# EAGLE design ZombieDelay (EAGLE 9.5.2)
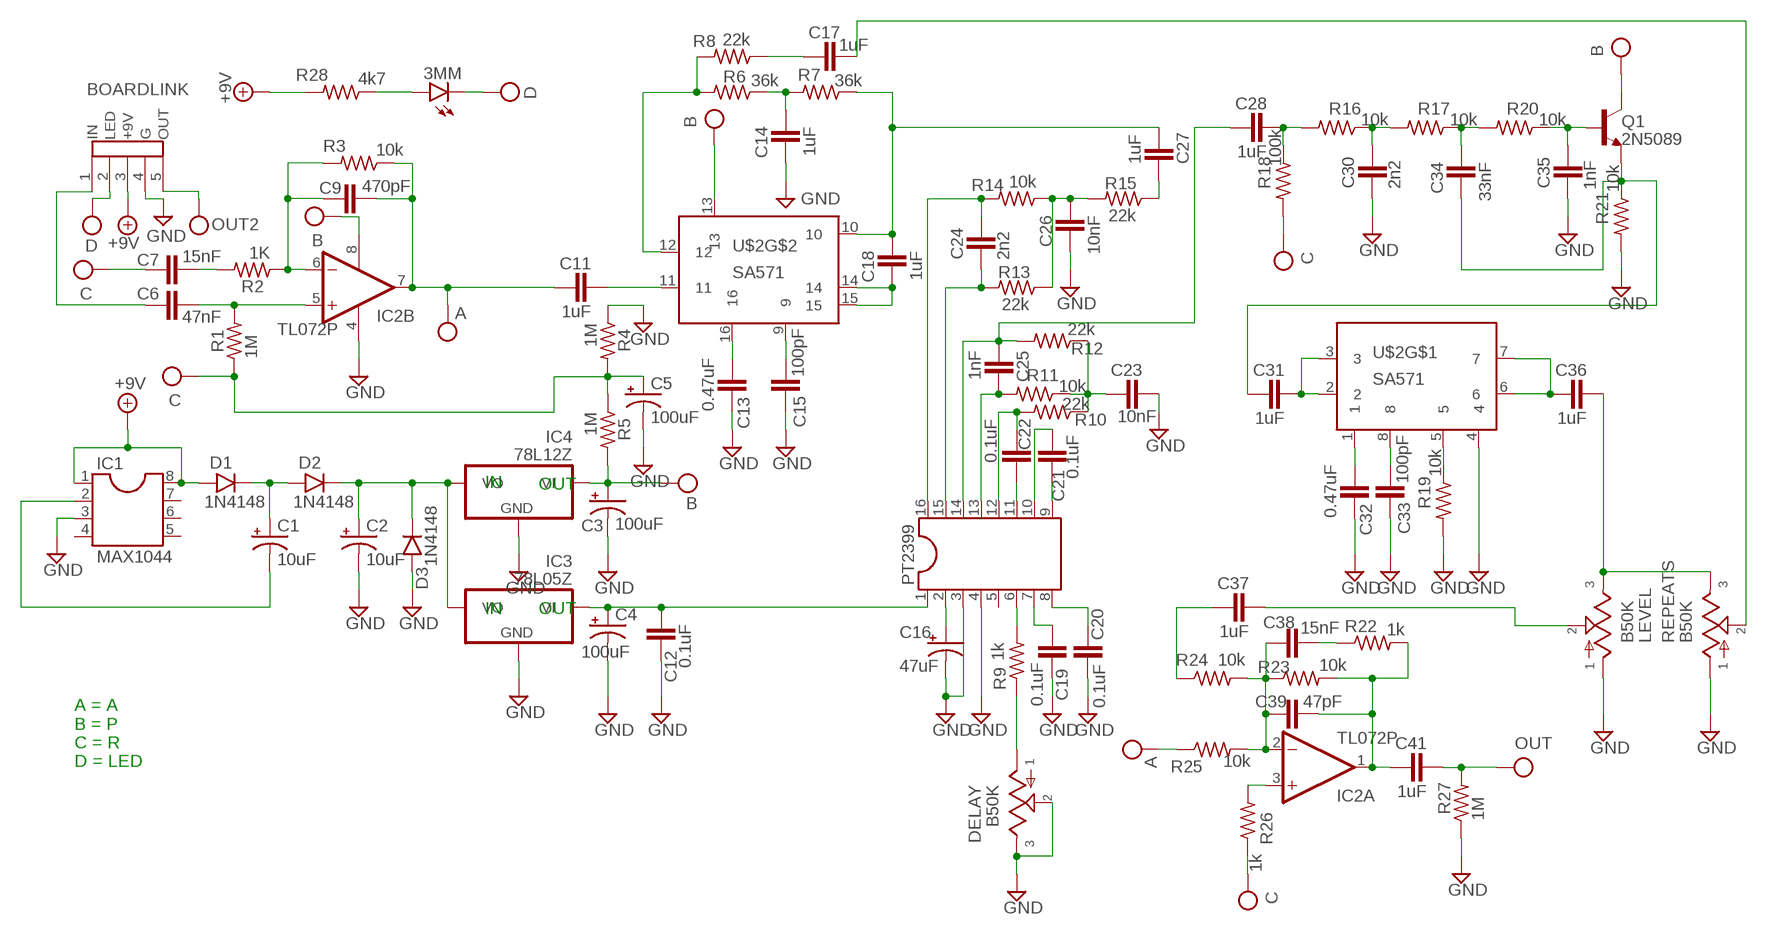
[diagram p0: schematic, sheet 1]

## Parts
3MM  LED3MM  [LED3MM]
C1  10uF  0501  [050_020_1]
C2  10uF  0501  [050_020_1]
C3  100uF  0801  [080_035_1]
C4  100uF  0801  [080_035_1]
C5  100uF  0801  [080_035_1]
C6  47nF  072X0352  [072X035]
C7  15nF  072X0252  [072X025]
C9  470pF  050X030_0251  [050X030_025]
C11  1uF  072X0452  [072X045]
C12  0.1uF  072X0352  [072X035]
C13  0.47uF  072X0352  [072X035]
C14  1uF  072X0452  [072X045]
C15  100pF  050X030_0251  [050X030_025]
C16  47uF  0631  [063_025]
C17  1uF  072X0452  [072X045]
C18  1uF  072X0452  [072X045]
C19  0.1uF  072X0352  [072X035]
C20  0.1uF  072X0352  [072X035]
C21  0.1uF  072X0352  [072X035]
C22  0.1uF  072X0352  [072X035]
C23  10nF  072X0252  [072X025]
C24  2n2  072X0252  [072X025]
C25  1nF  072X0252  [072X025]
C26  10nF  072X0252  [072X025]
C27  1uF  072X0452  [072X045]
C28  1uF  072X0452  [072X045]
C30  2n2  072X0252  [072X025]
C31  1uF  072X0452  [072X045]
C32  0.47uF  072X0352  [072X035]
C33  100pF  050X030_0251  [050X030_025]
C34  33nF  072X0252  [072X025]
C35  1nF  072X0252  [072X025]
C36  1uF  072X0452  [072X045]
C37  1uF  072X0452  [072X045]
C38  15nF  072X0252  [072X025]
C39  47pF  050X030_0251  [050X030_025]
C41  1uF  072X0452  [072X045]
D1  1N4148  1N4148-3  [DO35-3]
D2  1N4148  1N4148-3  [DO35-3]
D3  1N4148  1N4148-3  [DO35-3]
DELAY  B50K  POT16MM_PCB_PADS  [16MM_PCB_PADS]
IC1  MAX1044  [DIL08]
IC2  TL072P  [DIL08]
IC3  78L05Z  [TO92]
IC4  78L12Z  [TO92]
LEVEL  B50K  POT16MM_PCB_PADS  [16MM_PCB_PADS]
PT2399  DIL16  [DIL16]
Q1  2N5089  [TO92-]
R1  1M  6MM.3  [R0207/3]
R2  1K  6MM.3  [R0207/3]
R3  10k  6MM.3  [R0207/3]
R4  1M  6MM.3  [R0207/3]
R5  1M  6MM.3  [R0207/3]
R6  36k  6MM.3  [R0207/3]
R7  36k  6MM.3  [R0207/3]
R8  22k  6MM.3  [R0207/3]
R9  1k  6MM.3  [R0207/3]
R10  22k  6MM.3  [R0207/3]
R11  10k  6MM.3  [R0207/3]
R12  22k  6MM.3  [R0207/3]
R13  22k  6MM.3  [R0207/3]
R14  10k  6MM.3  [R0207/3]
R15  22k  6MM.3  [R0207/3]
R16  10k  6MM.3  [R0207/3]
R17  10k  6MM.3  [R0207/3]
R18  100k  6MM.3  [R0207/3]
R19  10k  6MM.3  [R0207/3]
R20  10k  6MM.3  [R0207/3]
R21  10k  6MM.3  [R0207/3]
R22  1k  6MM.3  [R0207/3]
R23  10k  6MM.3  [R0207/3]
R24  10k  6MM.3  [R0207/3]
R25  10k  6MM.3  [R0207/3]
R26  1k  6MM.3  [R0207/3]
R27  1M  6MM.3  [R0207/3]
R28  4k7  6MM.3  [R0207/3]
REPEATS  B50K  POT16MM_PCB_PADS  [16MM_PCB_PADS]
U$1  BOARDLINK  [BOARDLINK]
U$2  SA571  [DIL16]

## Nets
+9V: D1.A IC1.1 IC1.8 R28.2 U$1.3(+9V)
A: C9.2 C11.1 IC2.7(B:OUT) R3.1 R25.1
B: C3.+ IC2.8(P:V+) IC4.1(VI) Q1.1(C) R5.2 U$2.13
C: C5.+ C7.1 R1.1 R4.2 R5.1 R18.2 R26.1
D: 3MM.K(C) U$1.2(LED)
GND: C2.- C3.- C4.- C5.- C12.1 C13.2 C14.1 C15.1 C16.- C19.2 C20.2 C23.2 C26.1 C30.1 C32.2 C33.1 C35.1 D3.A DELAY.2 DELAY.3 IC1.3 IC2.4(P:V-) IC3.2(GND) IC4.2(GND) LEVEL.1 PT2399.3 PT2399.4 R4.1 R19.2 R21.2 R27.1 REPEATS.1 U$1.4(G) U$2.4
N$1: C2.+ D2.C D3.C IC3.3(VO) IC4.3(VO)
N$2: C1.+ D1.C D2.A
N$3: C1.- IC1.2
N$4: 3MM.A R28.1
N$5: C11.2 U$2.11
N$6: C4.+ C12.2 IC3.1(VI) PT2399.1
N$7: C6.1 U$1.1(IN)
N$8: C6.2 IC2.5(B:+IN) R1.2
N$9: C7.2 R2.2
N$10: C9.1 IC2.6(B:-IN) R2.1 R3.2
N$11: R6.2 R8.2 U$2.12
N$12: C17.1 R8.1
N$13: C14.2 R6.1 R7.2
N$14: C18.1 U$2.14 U$2.15
N$15: C18.2 C27.1 R7.1 U$2.10
N$16: C13.1 U$2.16
N$17: C15.2 U$2.9
N$18: C16.+ PT2399.2
N$19: PT2399.6 R9.2
N$20: DELAY.1 R9.1
N$21: C19.1 PT2399.7
N$22: C20.1 PT2399.8
N$23: C21.2 PT2399.9
N$24: C21.1 PT2399.10
N$25: C22.2 PT2399.11
N$26: C22.1 PT2399.12 R10.2
N$27: C23.1 R10.1 R11.1 R12.1
N$28: C25.1 PT2399.13 R11.2
N$29: C25.2 C28.1 PT2399.14 R12.2
N$30: C24.2 PT2399.16 R14.2
N$31: C24.1 PT2399.15 R13.2
N$32: C27.2 R15.1
N$33: C26.2 R13.1 R14.1 R15.2
N$34: C31.2 U$2.2 U$2.3
N$35: C28.2 R16.2 R18.1
N$36: C30.2 R16.1 R17.2
N$37: C34.2 R17.1 R20.2
N$38: C35.2 Q1.2(B) R20.1
N$39: C31.1 C34.1 Q1.3(E) R21.1
N$40: C38.2 C39.2 IC2.2(A:-IN) R23.1 R24.2 R25.2
N$41: IC2.3(A:+IN) R26.2
N$42: C36.1 U$2.6 U$2.7
N$43: C32.1 U$2.1
N$44: C33.2 U$2.8
N$45: R19.1 U$2.5
N$46: C37.2 LEVEL.2
N$48: C36.2 LEVEL.3 REPEATS.3
N$49: C37.1 R24.1
N$50: C38.1 R22.1
N$51: C39.1 C41.1 IC2.1(A:OUT) R22.2 R23.2
N$52: C17.2 REPEATS.2
OUT: C41.2 R27.2 U$1.5(OUT)
Unconnected: IC1.4 IC1.5 IC1.6 IC1.7 PT2399.5

## Notes on the sheet
- IN | OUT
- IN | OUT
- A = A
  B = P
  C = R
  D = LED

## Library data of the parts
3MM = mb_diodes:LED
C1 C2 = mb_caps-electro:050: 0.22 - 100uF Xicon values at Mouser.com: 10V: 10 - 100uF; 16V: 2.2 - 47uF; 25V: 0.47 - 47uF; 50V: 0.22 - 22uF
C3-C5 = mb_caps-electro:080: 47 - 470uF Xicon values at Mouser.com 10V: 330, 470uF; 16V: 220, 330uF; 25V: 220uF; 50V: 47, 100uF
C6 C12 C13 C19-C22 C32 = mb_caps-box:072X035: 0.15 - 1.0uF; WIMA MKP2 63, 100V: 0.047uF; MKS2 50V: 0.68 - 1.0uF; 63V: 0.33 - 0.47uF; 100V: 0.15 - 0.22uF;
C7 C23-C26 C30 C34 C35 C38 = mb_caps-box:072X025: 1000pF - 0.47uF WIMA MKP2 63, 100V: 1000pF - 0.015uF; MKS2 50V: 0.33 - 0.47uF; 63V: 1000pF - 0.22uF;
C9 C15 C33 C39 = mb_caps-ceramic:050X030_025: 47 - 120pF Xicon Ceramic Disc 2.5mm lead spacing
C11 C14 C17 C18 C27 C28 C31 C36 C37 C41 = mb_caps-box:072X045: 1.5uF WIMA MKS 2 50V: 1.5uF; 63V: 0.68uF; 100V: 0.33uF
C16 = mb_caps-electro:063: 33 - 220uF Xicon values at Mouser.com 10V: 220uF; 16V: 100uF; 25V: 100uF; 50V: 33uF
D1-D3 = mb_diodes:1N4148: Fast Switching Diode DO-35 glass case a.k.a. 1N914
DELAY LEVEL REPEATS = mb_pots:POT: Potentiometers the arrow indicates the clockwise motion of th wiper (lug 2) fully counter clockwise there is no resistance between lugs 1 and 2 fully clockwise the resistance between lugs 1 and 2 is the value of the pot
IC1 = mb_ics:MAX1044
IC2 = mb_ics:TL072: OP AMP
IC3 IC4 = mb_regulators:78*: Positive VOLTAGE REGULATOR Source: http://cache.national.com/ds/LM/LM78L05.pdf http://www.fairchildsemi.com/ds/LM/LM7805.pdf
PT2399 = mb_ics:DIL16
Q1 = mb_trans:2N5089: NPN TRANSISTOR EBC pinout also works for 2N3565
R1-R28 = mb_resistors:6MM: 6mm Resistors Leads spaced 1-6 holes apart for 0.1" perfboard. Suitable for 1/4 watt resistors.
U$1 = xc_library:BOARDLINK
U$2 = xc_library:SA571

## Board
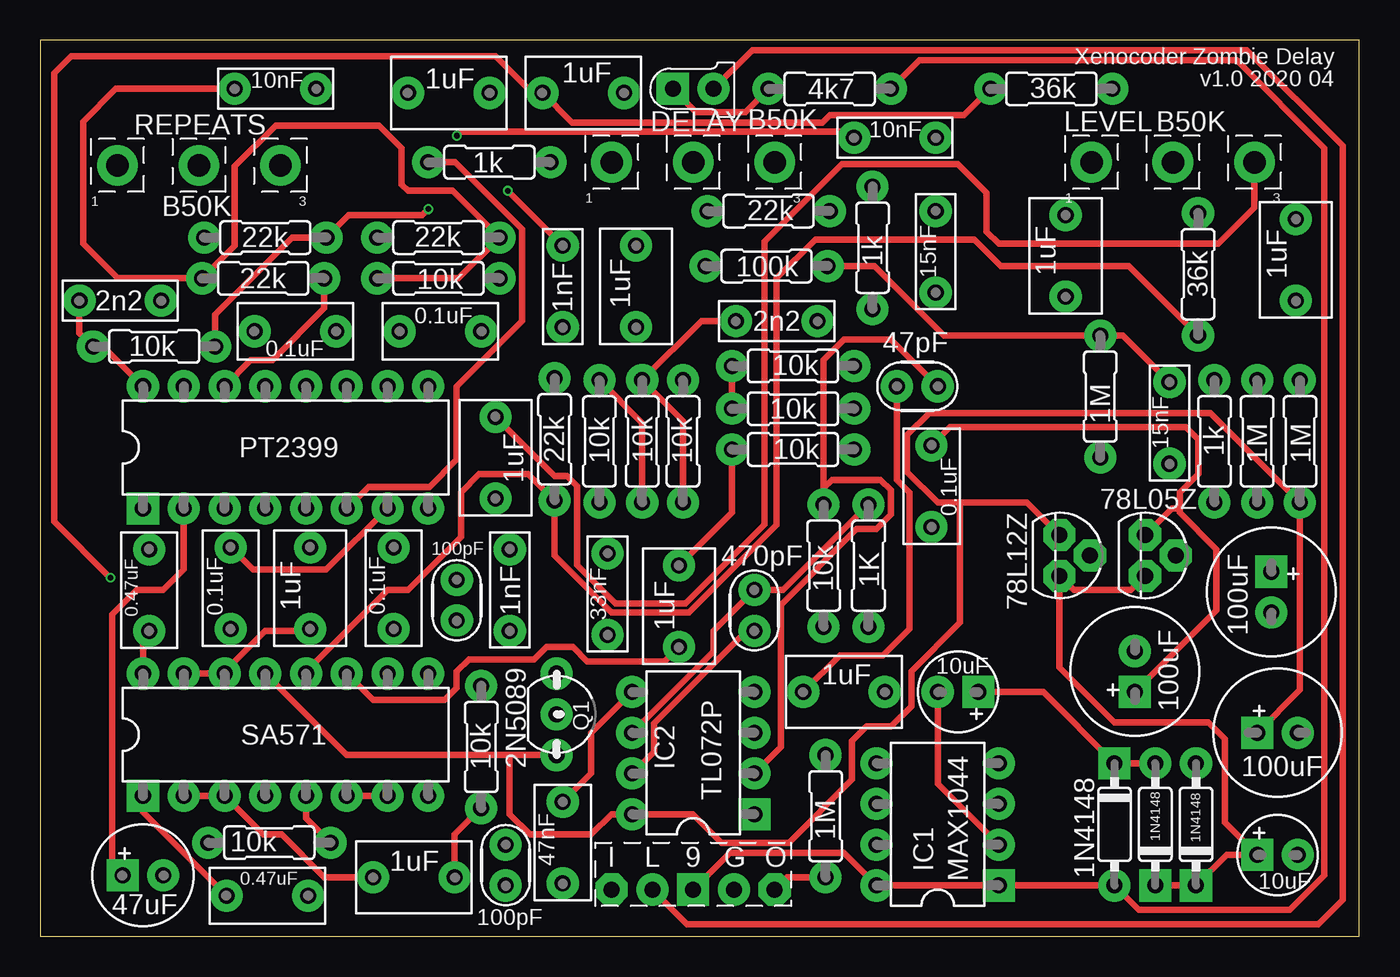
[diagram p1: board, top side]
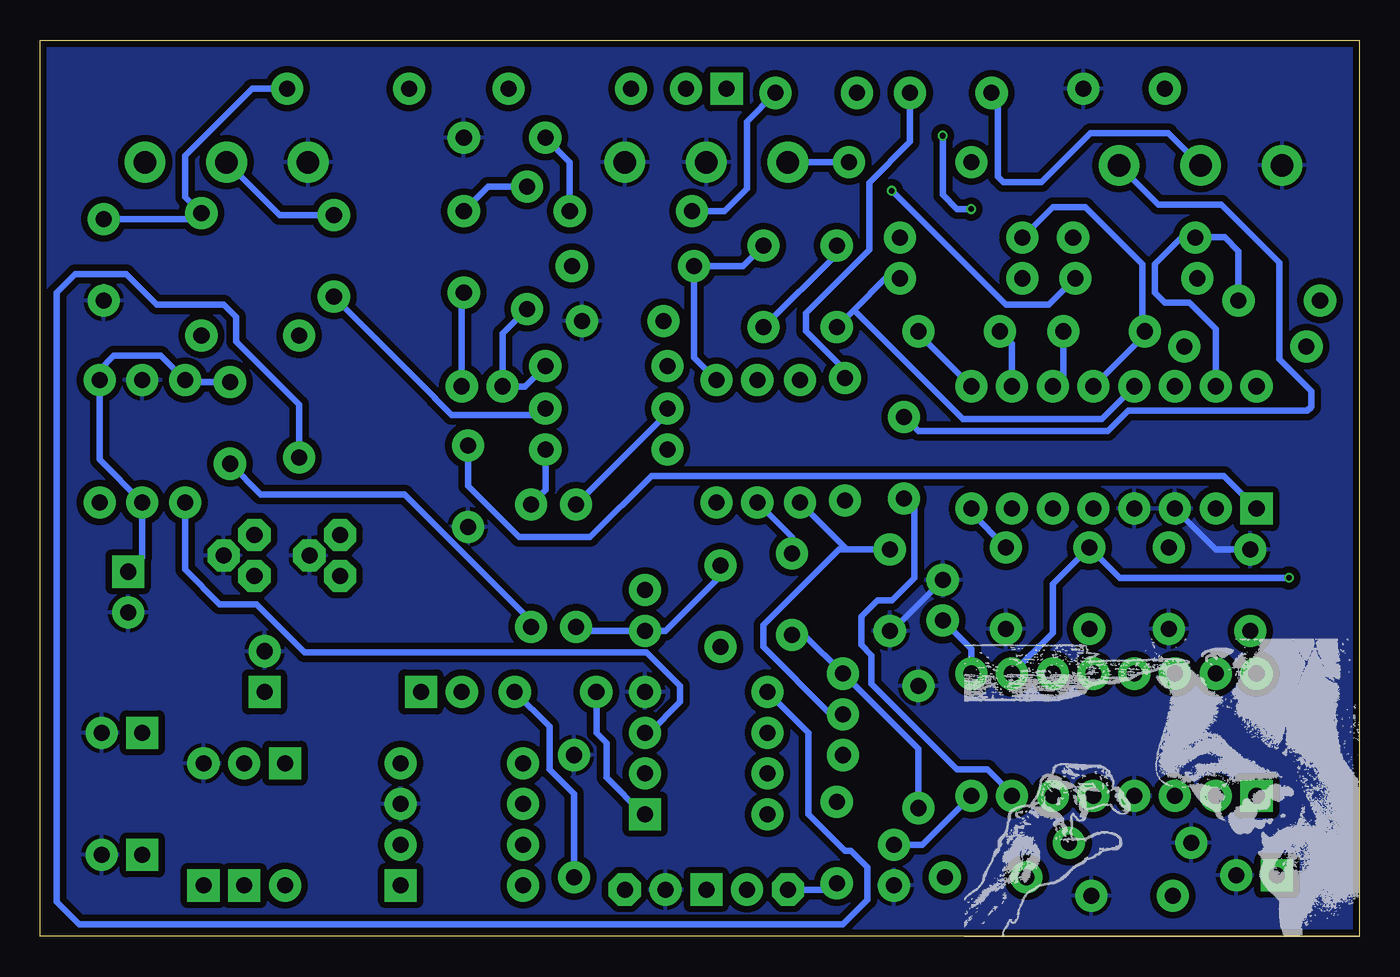
[diagram p2: board, bottom side, seen from below]

Size 82.22 x 55.87 mm. Coordinates in mm from the lower left corner, seen from the top.
Outline: 0,0 82.22,0 82.22,55.87 0,55.87 0,0
Copper layers (1*16): Top 0.035559375mm / dielectric 1.6mm / Bottom 0.035559375mm
Design rules "oshpark-2layer": minimum track width 6mil, minimum drill 10mil, track to track 6mil, track to pad 6mil, pad to pad 6mil, via to via 6mil, smd to smd 6mil, copper to edge 15mil, drill to drill 6mil, minimum pad ring 5mil, minimum via ring 5mil, stop-mask expansion 2.5mil, vias tented up to drill 0mil, thermal gap 10mil

### Footprints (pad centres in the part's own frame; a part is rotated, then mirrored left to right if it is on the bottom)
LED3MM = drill 1 pad 2 square: A -1.27,0 | drill 1 pad 2: K 1.27,0
050_020_1 = drill 1 pad 2 square: + -1.27,0 | drill 1 pad 2: - 1.27,0
080_035_1 = drill 1 pad 2 square: + -1.27,0 | drill 1 pad 2: - 1.27,0
072X035 = drill 1 pad 2: 1 -2.54,0; 2 2.54,0
072X025 = drill 1 pad 2: 1 -2.54,0; 2 2.54,0
050X030_025 = drill 1 pad 2: 1 -1.27,0; 2 1.27,0
072X045 = drill 1 pad 2: 1 -2.54,0; 2 2.54,0
063_025 = drill 1 pad 2 square: + -1.27,0 | drill 1 pad 2: - 1.27,0
DO35-3 = drill 1 pad 2: A 3.81,0 | drill 1 pad 2 square: C -3.81,0
16MM_PCB_PADS = drill 1.4 pad 2.54: 1 5.08,0; 2 0,0; 3 -5.08,0
DIL08 = drill 1 pad 2 square: 1 -3.81,-3.81 | drill 1 pad 2: 2 -1.27,-3.81; 3 1.27,-3.81; 4 3.81,-3.81; 5 3.81,3.81; 6 1.27,3.81; 7 -1.27,3.81; 8 -3.81,3.81
TO92 = drill 1 pad 2 octagon: 1 -1.27,0; 2 0,1.905; 3 1.27,0
DIL16 = drill 1 pad 2 square: 1 -8.89,-3.81 | drill 1 pad 2: 2 -6.35,-3.81; 3 -3.81,-3.81; 4 -1.27,-3.81; 5 1.27,-3.81; 6 3.81,-3.81; 7 6.35,-3.81; 8 8.89,-3.81; 9 8.89,3.81; 10 6.35,3.81; 11 3.81,3.81; 12 1.27,3.81; 13 -1.27,3.81; 14 -3.81,3.81; 15 -6.35,3.81; 16 -8.89,3.81
TO92- = drill 1 pad 2: 1 2.54,0; 2 0,0; 3 -2.54,0
R0207/3 = drill 1 pad 2: 1 -3.81,0; 2 3.81,0
BOARDLINK = drill 1 pad 2 octagon: 1 -2.54,0; 5 7.62,0 | drill 1 pad 2: 2 0,0; 4 5.08,0 | drill 1 pad 2 square: 3 2.54,0

### Placement (x,y rotation side)
3MM  40.7,52.83 0 top
C1  57.21,15.24 180 top
C2  77.12,5.08 0 top
C3  77.12,12.7 0 top
C4  68.23,16.51 90 top
C5  76.74,21.46 270 top
C6  32.57,5.84 90 top
C7  70.39,32 270 top
C9  44.51,20.32 270 top
C11  39.81,20.57 270 top
C12  55.56,28.07 90 top
C13  6.79,21.59 90 top
C14  78.26,42.16 90 top
C15  25.97,20.95 270 top
C16  6.41,3.81 0 top
C17  25.46,52.58 180 top
C18  16.82,21.72 90 top
C19  11.87,21.72 270 top
C20  22.03,21.72 270 top
C21  24.95,37.72 0 top
C22  15.9,37.72 0 top
C23  14.66,52.83 0 top
C24  4.99,39.62 180 top
C25  32.57,40.51 90 top
C26  53.27,49.78 180 top
C27  33.84,52.58 0 top
C28  37.14,40.51 90 top
C30  45.91,38.35 180 top
C31  23.3,3.68 180 top
C32  14.16,2.54 0 top
C33  29.02,4.45 90 top
C34  35.37,21.34 90 top
C35  29.27,21.59 90 top
C36  28.38,29.84 90 top
C37  63.91,42.42 90 top
C38  55.81,42.67 270 top
C39  54.67,34.29 0 top
C41  50.1,15.24 0 top
D1  66.96,6.99 270 top
D2  69.5,6.99 90 top
D3  72.04,6.99 90 top
DELAY  40.7,48.26 180 top
IC1  55.94,6.99 90 top
IC2  40.7,11.43 90 top
IC3  68.86,23.75 270 top
IC4  63.53,23.75 270 top
LEVEL  70.6,48.26 180 top
PT2399  15.3,30.48 0 top
Q1  32.19,13.84 270 top
R1  66.07,33.66 270 top
R2  51.62,23.11 270 top
R3  46.92,30.35 0 top
R4  75.85,30.86 270 top
R5  78.52,30.86 270 top
R6  72.17,41.27 270 top
R7  63.02,52.83 0 top
R8  32.06,30.99 270 top
R9  28,48.26 180 top
R10  24.82,43.56 180 top
R11  24.82,41.02 0 top
R12  13.9,41.02 0 top
R13  14.03,43.56 180 top
R14  7.11,36.77 180 top
R15  45.4,45.21 0 top
R16  40.06,30.86 90 top
R17  37.52,30.86 90 top
R18  45.27,41.78 0 top
R19  14.28,5.84 180 top
R20  34.86,30.86 90 top
R21  27.49,11.81 90 top
R22  51.88,42.93 270 top
R23  46.92,35.56 0 top
R24  46.92,32.89 180 top
R25  48.83,23.11 90 top
R26  73.18,30.86 270 top
R27  48.95,7.49 270 top
R28  49.21,52.83 0 top
REPEATS  9.9,48.06 180 top
U$1  38.16,2.92 0 top
U$2  15.3,12.57 0 top

### Tracks (layer width: path | path; a pad name or v marks a point on that pad's centre or on a via)
+9V
  Top 0.406: U$1.3 42.99,5.21 50.1,5.21 IC1.8 IC1.1 D1.A 68.48,1.65 77.88,1.65 80.04,3.81 80.04,49.15 74.58,54.61 54.8,54.61 R28.2
A
  Top 0.406: IC2.7 38.25,11.52 38.25,13.27 44.03,19.05 C9.2 | C11.1 43.11,26.42 R3.1
  Bottom 0.406: R25.1 48.57,19.05 C9.2 43.24,19.05 39.81,22.48 C11.1
B
  Top 0.406: Q1.1 29.27,11.3 | 29.27,11.3 19.11,11.3 U$2.13 | 29.27,11.3 29.27,7.62 30.54,6.35 34.35,6.35 35.62,7.62 IC2.8 40.7,7.62 42.48,5.84 46.67,5.84 50.61,9.78 50.61,12.19 51.49,13.08 53.02,13.08 54.29,14.35 54.29,16.51 57.34,19.56 57.34,27.05 | C3.+ 78.52,15.37 R5.2 72.93,32.64 55.43,32.64 54.03,31.24 54.03,28.96 55.94,27.05 57.34,27.05 | 57.34,27.05 61.5,27.05 IC4.1
C
  Top 0.406: R18.2 52,41.78 56.32,37.47 R1.1 67.47,37.47 C7.1
  Bottom 0.406: C7.1 73.06,34.54 R26.1 74.71,36.2 77.63,36.2 78.52,35.31 R5.1 78.52,29.72 R4.2 75.85,23.62 C5.+
D
  Top 0.406: U$1.2 40.32,0.76 79.66,0.76 81.18,2.29 81.18,49.28 75.22,55.24 44.38,55.24 3MM.K
GND
  Bottom 0.406: PT2399.3 8.95,24.13 C13.2 | C35.1 29.14,19.05 C15.1
  pour Bottom (isolate 0.406): 0,0 0,55.88 82.55,55.88 82.55,0
N$1
  Top 0.406: D2.C D3.C 73.94,5.08 C2.+ 73.82,7.11 73.82,12.32 72.8,13.34 66.96,13.34 63.53,16.76 IC4.3 64.42,21.59 67.98,21.59 IC3.3
N$2
  Top 0.406: D2.A D1.C 62.52,15.24 C1.+
N$3
  Top 0.406: IC1.2 55.94,9.53 C1.-
N$4
  Top 0.406: R28.1 43.95,51.38 40.88,51.38 3MM.A
N$5
  Top 0.406: U$2.11 20.76,14.73 25.21,14.73 25.97,15.49 25.97,16.51 26.73,17.27 30.79,17.27 31.56,18.03 33.21,18.03 34.1,17.14 38.92,17.14 C11.2
N$6
  Top 0.406: C12.2 56.7,31.75 71.41,31.75 72.17,30.99 72.17,28.83 71.02,27.69 71.02,26.67 | 71.02,26.67 71.02,26.42 73.31,24.13 73.31,20.32 C4.+ | IC3.1 70.52,26.67 71.02,26.67
  Bottom 0.406: PT2399.1 8.44,28.7 44.13,28.7 47.94,24.89 52.38,24.89 55.56,28.07 C12.2
N$7
  Bottom 0.406: U$1.1 32.95,2.92 C6.1
N$8
  Top 0.406: IC2.5 34.35,12.7 34.35,10.16 C6.2
  Bottom 0.406: IC2.5 34.35,12.7 34.35,7.62 32.06,5.33 31.68,5.33 30.67,4.32 30.67,2.29 32.19,0.76 79.79,0.76 81.18,2.16 81.18,40.13 80.04,41.27 76.87,41.27 74.96,39.37 70.77,39.37 70.01,38.61 70.01,37.08 66.07,33.15 R1.2
N$9
  Bottom 0.406: C7.2 68.48,27.56 59.51,27.56 51.62,19.67 R2.2
N$10
  Top 0.406: IC2.6 41.97,17.78 41.97,19.05 C9.1 46.29,21.59 R2.1
  Bottom 0.406: R3.2 50.73,27.81 R2.1
N$11
  Top 0.406: U$2.12 16.57,16.51 21.65,21.59 22.92,21.59 26.22,24.89 26.22,27.69 27.36,28.83 30.41,28.83 R8.2 32.06,23.75 35.62,20.19 40.45,20.19 45.91,25.65 45.91,41.02 48.32,43.43 58.23,43.43 59.88,41.78 67.85,41.78 R6.2
N$12
  Bottom 0.406: R8.1 32.06,35.31 34.48,37.72 34.48,38.86 30.54,42.8 30.54,46.99 28,49.53 C17.1
N$13
  Bottom 0.406: C14.2 72.55,44.7 R6.1 73.17,46.09 73.17,48.66 68.99,52.83 R7.2
N$14
  Top 0.406: U$2.15 U$2.14 11.49,16.51 14.03,19.05 16.7,19.05 C18.1
N$15  (via drill 0.35)
  Top 0.406: v4.38,22.35 0.87,25.86 0.87,53.79 1.94,54.86 28.38,54.86 30.67,52.58 C27.1 33.16,50.72 48.75,50.72 49.21,51.18 57.56,51.18 R7.1
  Bottom 0.406: U$2.10 19.11,18.92 19.11,21.97 C18.2 14.92,22.35 v4.38,22.35
N$16
  Top 0.406: U$2.16 6.41,18.67 C13.1
N$17
  Bottom 0.406: U$2.9 24.19,17.91 C15.2
N$18
  Top 0.406: PT2399.2 8.95,22.86 7.68,21.59 6.03,21.59 4.5,20.07 4.5,4.45 C16.+
N$19
  Top 0.406: PT2399.6 20.47,28.03 24.28,28.03 25.97,29.72 25.97,34.28 30.03,38.34 30.03,44.08 25.85,48.26 R9.2
N$20
  Bottom 0.406: DELAY.1 R9.1
N$21
  Top 0.406: C19.1 13.27,22.86 17.84,22.86 PT2399.7
N$22
  Bottom 0.406: C20.1 24.19,26.42 PT2399.8
N$23
  Bottom 0.406: PT2399.9 27.49,37.59 C21.2
N$24
  Bottom 0.406: PT2399.10 21.65,36.96 C21.1
N$25
  Bottom 0.406: PT2399.11 18.44,34.96 C22.2
N$26
  Bottom 0.406: C22.1 13.36,37.5 13.46,37.4 | 13.46,37.4 PT2399.12 | R10.2 19.11,45.47 17.08,45.47 13.52,41.91 13.52,37.47 13.46,37.4
N$27
  Top 0.406: C23.1 4.71,52.83 2.68,50.8 2.68,43.18 4.84,41.02 R12.1 12.12,43.05 12.12,48.01 14.66,50.55 21.14,50.55 22.54,49.15 22.54,46.86 22.92,46.48 25.71,46.48 R10.1 26.09,41.02 R11.1
N$28
  Bottom 0.406: C25.1 31.49,39.05 | 31.49,39.05 29.52,41.02 R11.2 | PT2399.13 16.06,32.26 24.7,32.26 31.49,39.05
N$29  (via drill 0.35)
  Top 0.406: PT2399.14 13.13,35.93 14.49,35.93 17.71,39.15 R12.2 | v29.14,46.48 C25.2
  Bottom 0.406: C28.1 32.57,42.55 C25.2 | R12.2 19.36,39.37 22.03,39.37 v29.14,46.48
N$30
  Top 0.406: C24.2 2.45,37.62 R14.2 3.92,36.77 PT2399.16
N$31
  Bottom 0.406: PT2399.15 8.95,37.85 10.6,39.5 12.12,39.5 12.76,40.13 12.76,41.91 11.11,43.56 R13.2 10.18,43.6 8.4,43.6 7.53,42.73 C24.1
N$32
  Bottom 0.406: R15.1 39.56,45.21 38.16,46.61 38.16,50.8 C27.2
N$33  (via drill 0.35)
  Top 0.406: R14.1 10.92,38.77 15.7,43.56 R13.1 19.24,44.96 23.81,44.96 v24.19,45.34 | v25.97,49.91 26.22,50.16 50.35,50.16 C26.2
  Bottom 0.406: C26.2 49.21,48.26 R15.2 | v25.97,49.91 25.97,46.23 25.08,45.34 v24.19,45.34
N$34
  Top 0.406: U$2.2 U$2.3 13.9,6.35 15.05,6.35 17.71,3.68 C31.2
N$35
  Bottom 0.406: C28.2 38.41,41.78 R18.1 41.46,36.07 R16.2
N$36
  Top 0.406: R16.1 40.06,32.13 R17.2 41.21,38.35 C30.2
N$37
  Top 0.406: R20.2 37.52,32 R17.1
  Bottom 0.406: C34.2 35.37,24.89 R17.1
N$38
  Bottom 0.406: Q1.2 32.95,13.84 37.14,18.03 37.14,19.43 32.45,24.13 C35.2 31.94,24.13 R20.1
N$39
  Top 0.406: C31.1 25.84,6.35 R21.1
  Bottom 0.406: C34.1 34.6,18.8 Q1.3 27.49,11.68 R21.1
N$40
  Top 0.406: R25.2 48.83,27.94 | 48.83,27.94 48.83,35.94 50.1,37.21 53.02,37.21 C39.2 | R23.1 R24.2 | IC2.2 46.16,11.81 46.16,20.67 50.89,25.4 52.13,25.4 53.02,26.29 53.02,27.81 52.38,28.45 49.34,28.45 48.83,27.94
  Bottom 0.406: R25.2 43.11,32.64 R24.2 | C38.2 55.94,40.01 C39.2
N$41
  Bottom 0.406: IC2.3 44.26,12.7 42.35,14.61 42.35,15.62 44.42,17.69 65.73,17.69 68.74,20.7 71.02,20.7 73.18,22.86 R26.2
N$42
  Top 0.406: U$2.7 U$2.6
  Bottom 0.406: C36.1 27.75,26.67 27.75,22.35 29.14,20.95 30.03,20.95 31.05,19.94 31.05,18.16 30.41,17.53 30.41,15.75 25.08,10.41 23.17,10.41 21.65,8.89 U$2.7
N$43
  Top 0.406: C32.1 6.41,7.75 U$2.1
N$44
  Bottom 0.406: C33.2 27.24,5.71 U$2.8
N$45
  Top 0.406: R19.1 16.57,7.37 U$2.5
N$46
  Bottom 0.406: C37.2 67.3,44.96 LEVEL.2
N$48
  Top 0.406: LEVEL.3 75.68,45.42 73.44,43.18 59.75,43.18 58.99,43.94 58.99,46.35 57.21,48.13 49.97,48.13 45.15,43.31 45.15,25.68 40.22,20.75 35.87,20.75 33.46,23.16 33.46,28.07 32.83,28.7 32.06,28.7 C36.2
  Bottom 0.406: C36.2 27.49,31.5 15.68,31.5 14.41,32.77 3.23,32.77 3,33 3,34 5,36 5,42 8.6,45.6 12.52,45.6 REPEATS.3
N$49
  Bottom 0.406: C37.1 57.59,33.56 57.59,33.53 56.58,32.51 51.11,32.51 R24.1
N$50
  Bottom 0.406: R22.1 54.29,46.74 C38.1
N$51
  Top 0.406: C41.1 49.84,17.53 52.51,17.53 54.16,19.18 54.16,27.69 53.4,28.45 C39.1
  Bottom 0.406: R22.2 53.4,37.59 C39.1 52,34.29 R23.2 | C41.1 47.56,12.7 46.92,12.06 46.92,9.91 44.64,7.62 IC2.1
N$52
  Bottom 0.406: REPEATS.2 11.9,50.06 16.77,50.06 19.8,47.02 22.19,47.02 22.54,47.37 22.54,52.2 C17.2
OUT
  Top 0.406: U$1.5 46.54,3.68 R27.2
  Bottom 0.406: C41.2 50.48,13.08 50.48,10.41 48.95,8.89 R27.2

### Text on the board
tNames: Xenocoder Zombie Delay / v1.0 2020 04
bNames: /Users/evanhowell/Downloads/ZombiePedal.bmp